# EAGLE schematic 4port (EAGLE 6.5.0)

## Sheet 1 of 3
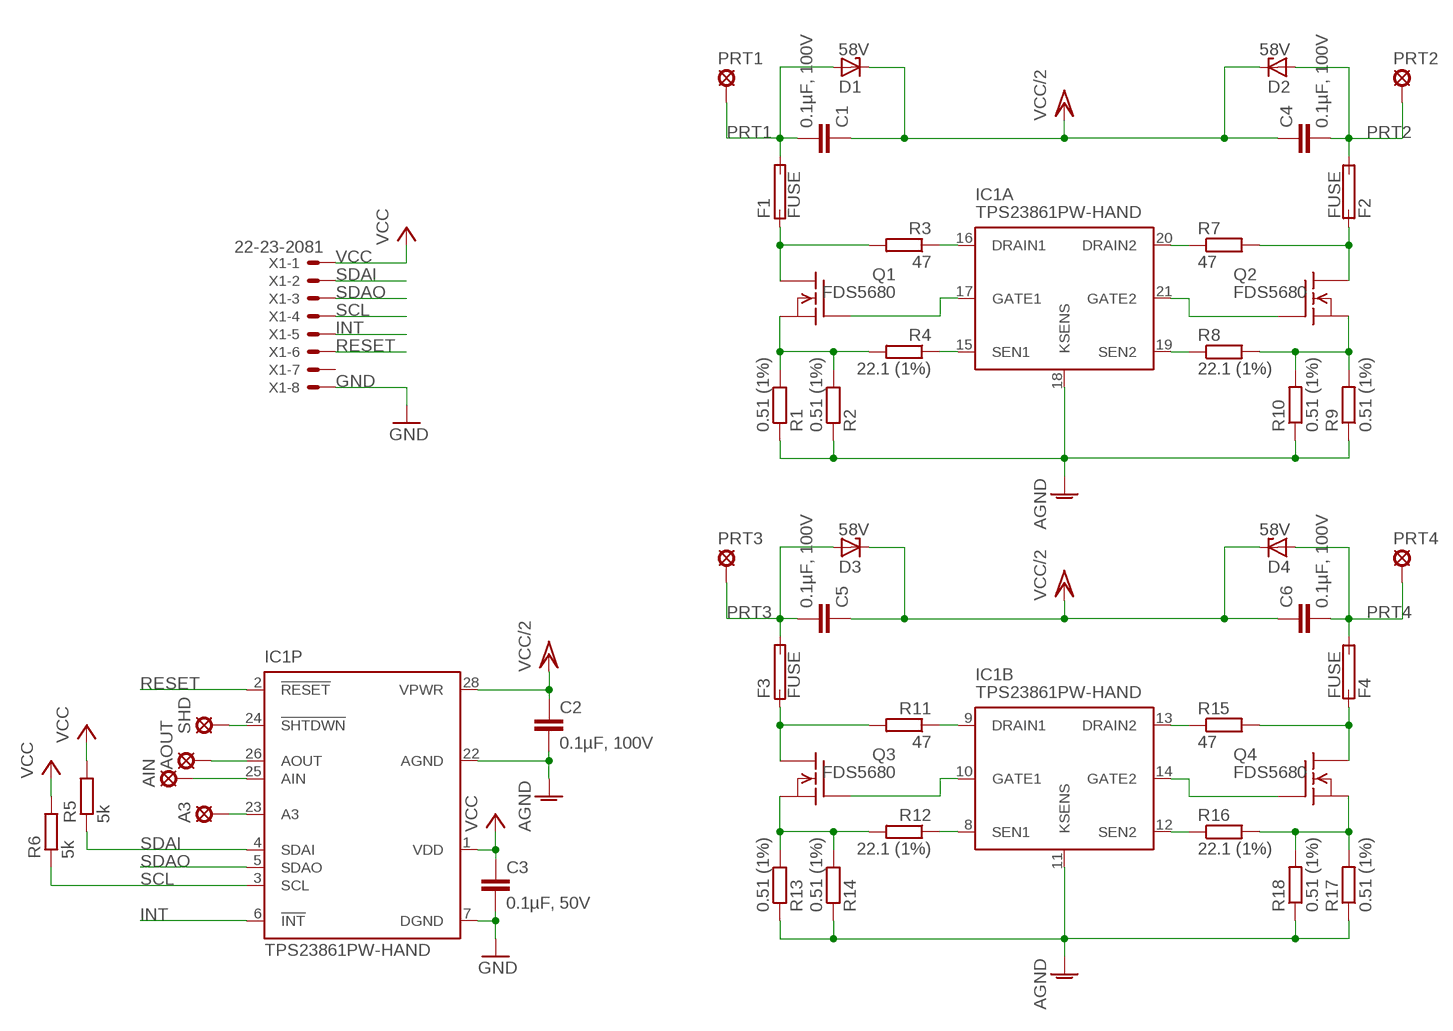
[diagram p0: schematic, sheet 1]

### Parts
A3  SE14  [SE14]
AIN  SE14  [SE14]
AOUT  SE14  [SE14]
C1  0.1µF, 100V  C-EUC0805K  [C0805K]
C2  0.1µF, 100V  C-EUC0805K  [C0805K]
C3  0.1µF, 50V  C-EUC0805K  [C0805K]
C4  0.1µF, 100V  C-EUC0805K  [C0805K]
C5  0.1µF, 100V  C-EUC0805K  [C0805K]
C6  0.1µF, 100V  C-EUC0805K  [C0805K]
D1  58V  ZENER-DIODESMB  [SMB]
D2  58V  ZENER-DIODESMB  [SMB]
D3  58V  ZENER-DIODESMB  [SMB]
D4  58V  ZENER-DIODESMB  [SMB]
F1  FUSE  [R1206W]
F2  FUSE  [R1206W]
F3  FUSE  [R1206W]
F4  FUSE  [R1206W]
IC1  TPS23861PW-HAND  [PW_R-PDSO-G28_HAND]
PRT1  SE14  [SE14]
PRT2  SE14  [SE14]
PRT3  SE14  [SE14]
PRT4  SE14  [SE14]
Q1  FDS5680  [SO-8]
Q2  FDS5680  [SO-8]
Q3  FDS5680  [SO-8]
Q4  FDS5680  [SO-8]
R1  0.51 (1%)  R-EU_R0603  [R0603]
R2  0.51 (1%)  R-EU_R0603  [R0603]
R3  47  R-EU_R0603  [R0603]
R4  22.1 (1%)  R-EU_R0603  [R0603]
R5  5k  R-EU_R0805W  [R0805W]
R6  5k  R-EU_R0805W  [R0805W]
R7  47  R-EU_R0603  [R0603]
R8  22.1 (1%)  R-EU_R0603  [R0603]
R9  0.51 (1%)  R-EU_R0603  [R0603]
R10  0.51 (1%)  R-EU_R0603  [R0603]
R11  47  R-EU_R0603  [R0603]
R12  22.1 (1%)  R-EU_R0603  [R0603]
R13  0.51 (1%)  R-EU_R0603  [R0603]
R14  0.51 (1%)  R-EU_R0603  [R0603]
R15  47  R-EU_R0603  [R0603]
R16  22.1 (1%)  R-EU_R0603  [R0603]
R17  0.51 (1%)  R-EU_R0603  [R0603]
R18  0.51 (1%)  R-EU_R0603  [R0603]
SHD  SE14  [SE14]
X1  22-23-2081  [22-23-2081]

### Nets
AGND: C2.2 IC1.11(B:KSENS) IC1.18(A:KSENS) IC1.22(P:AGND) R1.1 R2.1 R9.1 R10.1 R13.1 R14.1 R17.1 R18.1
GND: C3.2 IC1.7(P:DGND) X1.8 ; also sheet 3
INT: IC1.6(P:!INT) X1.5
N$11: IC1.16(A:DRAIN1) R3.1
N$12: IC1.15(A:SEN1) R4.1
N$13: Q1.1(S) Q1.2(S) Q1.3(S) R1.2 R2.2 R4.2
N$15: IC1.17(A:GATE1) Q1.4(G)
N$18: IC1.20(A:DRAIN2) R7.1
N$55: AOUT.MP IC1.26(P:AOUT)
N$56: AIN.MP IC1.25(P:AIN)
N$57: A3.MP IC1.23(P:A3)
N$58: IC1.24(P:!SHTDWN) SHD.MP
N$59: IC1.19(A:SEN2) R8.1
N$60: Q2.1(S) Q2.2(S) Q2.3(S) R8.2 R9.2 R10.2
N$61: IC1.21(A:GATE2) Q2.4(G)
N$63: IC1.9(B:DRAIN1) R11.1
N$64: IC1.8(B:SEN1) R12.1
N$65: Q3.1(S) Q3.2(S) Q3.3(S) R12.2 R13.2 R14.2
N$66: IC1.10(B:GATE1) Q3.4(G)
N$68: IC1.13(B:DRAIN2) R15.1
N$69: IC1.12(B:SEN2) R16.1
N$70: Q4.1(S) Q4.2(S) Q4.3(S) R16.2 R17.2 R18.2
N$71: IC1.14(B:GATE2) Q4.4(G)
N$100: F1.1(1A) Q1.5(D) Q1.6(D) Q1.7(D) Q1.8(D) R3.2
N$101: F2.1(1A) Q2.5(D) Q2.6(D) Q2.7(D) Q2.8(D) R7.2
N$102: F3.1(1A) Q3.5(D) Q3.6(D) Q3.7(D) Q3.8(D) R11.2
N$103: F4.1(1A) Q4.5(D) Q4.6(D) Q4.7(D) Q4.8(D) R15.2
PRT1: C1.2 D1.A F1.2(2A) PRT1.MP ; also sheet 2
PRT2: C4.2 D2.A F2.2(2A) PRT2.MP ; also sheet 2
PRT3: C5.2 D3.A F3.2(2A) PRT3.MP ; also sheet 2
PRT4: C6.2 D4.A F4.2(2A) PRT4.MP ; also sheet 2
RESET: IC1.2(P:!RESET) X1.6
SCL: IC1.3(P:SCL) R6.1 X1.4
SDAI: IC1.4(P:SDAI) R5.1 X1.2
SDAO: IC1.5(P:SDAO) X1.3
VCC: C3.1 IC1.1(P:VDD) R5.2 R6.2 X1.1
VCC/2: C1.1 C2.1 C4.1 C5.1 C6.1 D1.C D2.C D3.C D4.C IC1.28(P:VPWR) ; also sheet 2
Unconnected: X1.7

## Sheet 2 of 3
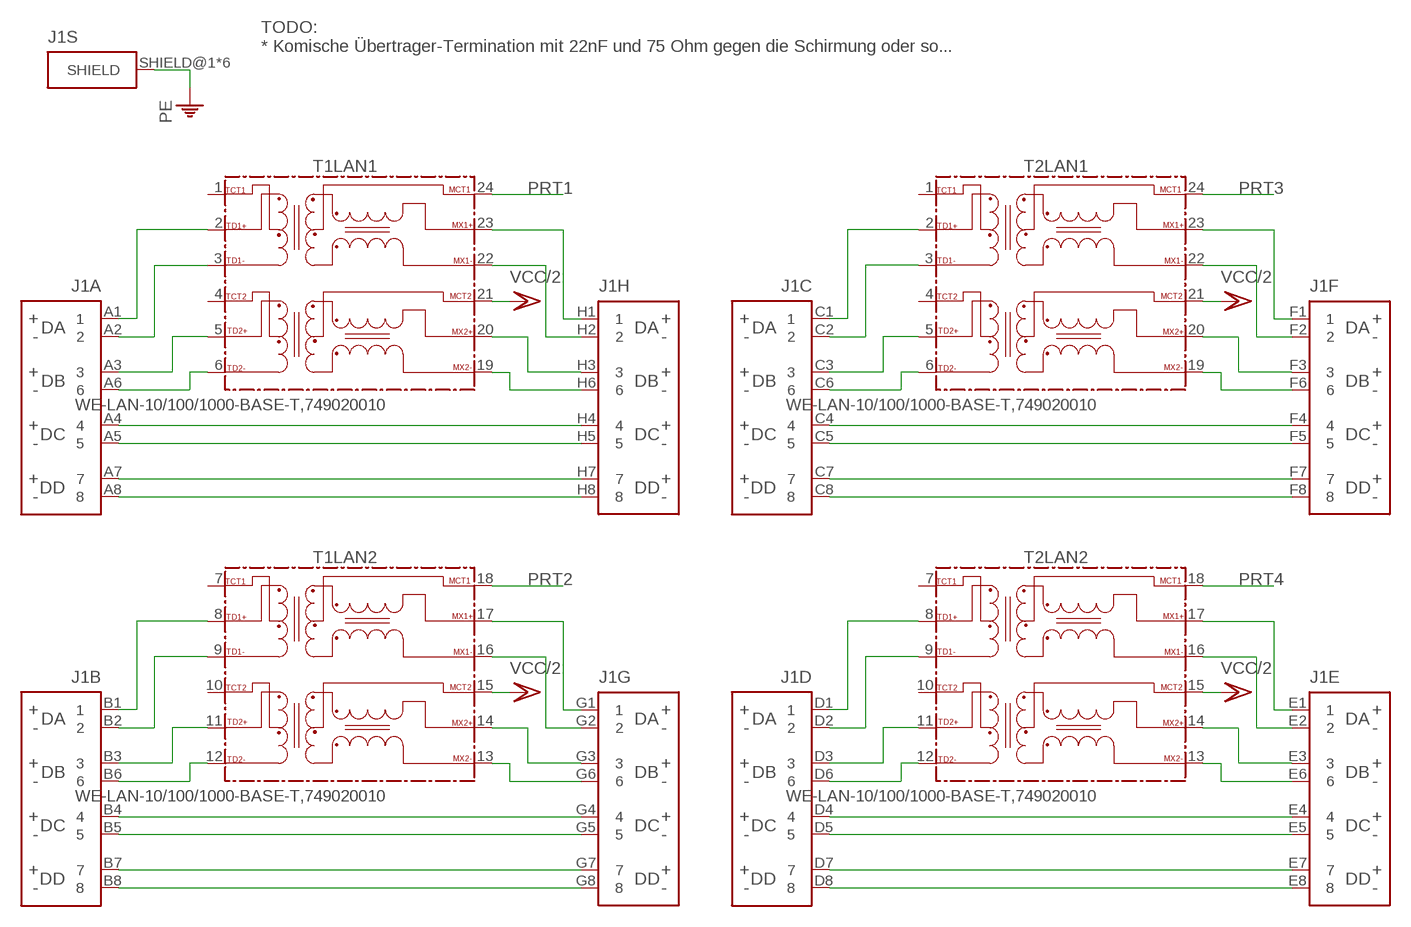
[diagram p1: schematic, sheet 2]

### Parts
J1  615064243321  [615064243321]
T1  WE-LAN-10/100/1000-BASE-T,749020010  [749020010]
T2  WE-LAN-10/100/1000-BASE-T,749020010  [749020010]

### Nets
N$1: J1.A4 J1.H4
N$2: J1.A5 J1.H5
N$3: J1.A7 J1.H7
N$4: J1.A8 J1.H8
N$5: J1.A6 T1.6(LAN1:TD2-)
N$6: J1.A3 T1.5(LAN1:TD2+)
N$7: J1.A2 T1.3(LAN1:TD1-)
N$8: J1.A1 T1.2(LAN1:TD1+)
N$9: J1.H6 T1.19(LAN1:MX2-)
N$10: J1.H3 T1.20(LAN1:MX2+)
N$14: J1.H2 T1.22(LAN1:MX1-)
N$17: J1.H1 T1.23(LAN1:MX1+)
N$19: J1.B4 J1.G4
N$20: J1.B5 J1.G5
N$21: J1.B7 J1.G7
N$22: J1.B8 J1.G8
N$23: J1.B6 T1.12(LAN2:TD2-)
N$24: J1.B3 T1.11(LAN2:TD2+)
N$25: J1.B2 T1.9(LAN2:TD1-)
N$26: J1.B1 T1.8(LAN2:TD1+)
N$27: J1.G6 T1.13(LAN2:MX2-)
N$28: J1.G3 T1.14(LAN2:MX2+)
N$29: J1.G2 T1.16(LAN2:MX1-)
N$30: J1.G1 T1.17(LAN2:MX1+)
N$31: J1.C4 J1.F4
N$32: J1.C5 J1.F5
N$33: J1.C7 J1.F7
N$34: J1.C8 J1.F8
N$35: J1.C6 T2.6(LAN1:TD2-)
N$36: J1.C3 T2.5(LAN1:TD2+)
N$37: J1.C2 T2.3(LAN1:TD1-)
N$38: J1.C1 T2.2(LAN1:TD1+)
N$39: J1.F6 T2.19(LAN1:MX2-)
N$40: J1.F3 T2.20(LAN1:MX2+)
N$41: J1.F2 T2.22(LAN1:MX1-)
N$42: J1.F1 T2.23(LAN1:MX1+)
N$43: J1.D4 J1.E4
N$44: J1.D5 J1.E5
N$45: J1.D7 J1.E7
N$46: J1.D8 J1.E8
N$47: J1.D6 T2.12(LAN2:TD2-)
N$48: J1.D3 T2.11(LAN2:TD2+)
N$49: J1.D2 T2.9(LAN2:TD1-)
N$50: J1.D1 T2.8(LAN2:TD1+)
N$51: J1.E6 T2.13(LAN2:MX2-)
N$52: J1.E3 T2.14(LAN2:MX2+)
N$53: J1.E2 T2.16(LAN2:MX1-)
N$54: J1.E1 T2.17(LAN2:MX1+)
PE: J1.SHIELD@1(S:SHIELD) J1.SHIELD@2(S:SHIELD) J1.SHIELD@3(S:SHIELD) J1.SHIELD@4(S:SHIELD) J1.SHIELD@5(S:SHIELD) J1.SHIELD@6(S:SHIELD)
PRT1: T1.24(LAN1:MCT1) ; also sheet 1
PRT2: T1.18(LAN2:MCT1) ; also sheet 1
PRT3: T2.24(LAN1:MCT1) ; also sheet 1
PRT4: T2.18(LAN2:MCT1) ; also sheet 1
VCC/2: T1.15(LAN2:MCT2) T1.21(LAN1:MCT2) T2.15(LAN2:MCT2) T2.21(LAN1:MCT2) ; also sheet 1
Unconnected: T1.1(LAN1:TCT1) T1.4(LAN1:TCT2) T1.7(LAN2:TCT1) T1.10(LAN2:TCT2) T2.1(LAN1:TCT1) T2.4(LAN1:TCT2) T2.7(LAN2:TCT1) T2.10(LAN2:TCT2)

### Notes on the sheet
- TODO:
  * Komische Übertrager-Termination mit 22nF und 75 Ohm gegen die Schirmung oder so...

## Sheet 3 of 3
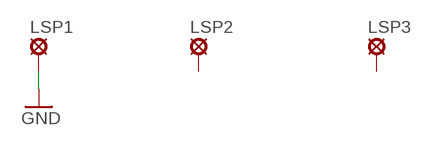
[diagram p2: schematic, sheet 3]

### Parts
LSP1  SE14  [SE14]
LSP2  SE14  [SE14]
LSP3  SE14  [SE14]

### Nets
GND: LSP1.MP ; also sheet 1
Unconnected: LSP2.MP LSP3.MP

## Library data of the parts
A3 AIN AOUT LSP1-LSP3 PRT1-PRT4 SHD = solpad:SE14: SOLDER PAD E1553, drill 1,4mm, distributor Buerklin, 07F820
C1-C6 = resistor:C-EU: CAPACITOR, European symbol
D1-D4 = diode:ZENER-DIODE: Z-Diode
F1-F4 = parts:FUSE
IC1 = parts:TPS23861
J1 = parts:615064243321: WR-MJ Horizontal Shielded 2 x 4 Stacked Port with EMI Panel Finger 8P8C Modular Jack Tab Up & Down, 64 Pins=>Code : Con-I-O_MJ-H_Shielded_Up-Down_615064243321 <http://katalog.we-online.de/media/images/eican/Con-I-O_MJ-H_Shielded_Up-Down_615064243321_pf2.jpg> Details see: http://katalog.we-online.de/en/em/615_064_243_321 Created 2014-07-10, Karrer Zheng 2014 (C) Würth Elektronik
Q1-Q4 = transistor-fet:FDS5680: 60V N-Channel PowerTrench TM MOSFET FAIRCHILD FDS5680.pdf
R1-R18 = resistor:R-EU_: RESISTOR, European symbol
T1 T2 = parts:WE-LAN-10/100/1000-BASE-T,749020010: LAN-Transformer WE-LAN 10/100/1000 Base Tx - Compliant with IEEE 802.3 standards - SMD -- Ethernet -- Power over Ethernet -- 1 Gigabit Ethernet -- Compliant with most IC's for ethernet applications like Intel, AMD, Globespan and Realtek -- Hub, Router, Switch <http://katalog.we-online.de/media/images/eisos/UtLAN_pf2.jpg> Details see: http://katalog.we-online.de/en/pbs/WE-LAN/S/749020010? Updated by Dan Xu 2014-07-08 2014 (C) Würth Elektronik; COMPANY-URL: http://www.we-online.de; CREATED-BY: Christin Zierenner; CREATED-DATE: June 2012; DATASHEET-URL: http://katalog.we-online.de/kataloge/eisos/media/pdf/749020010.pdf; MANUFACTURER: Würth Elektronik eiSos GmbH
X1 = con-molex:22-23-2081: .100" (2.54mm) Center Header - 8 Pin; MF: MOLEX; MPN: 22-23-2081; OC_FARNELL: 1756826; OC_NEWARK: 01C7592